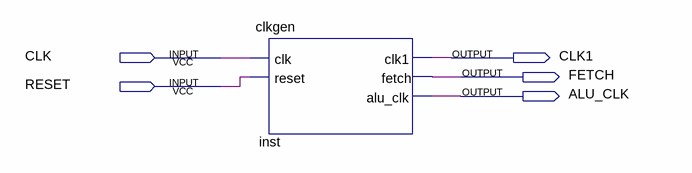
[diagram p0: schematic sheet]
// Quartus schematic clk_gen_bdf.bdf as structural Verilog: 1 symbols, 5 pins
module clk_gen_bdf (
  input  CLK,
  input  RESET,
  output CLK1,
  output FETCH,
  output ALU_CLK
);

  clkgen inst (.clk(CLK), .reset(RESET), .clk1(CLK1), .fetch(FETCH), .alu_clk(ALU_CLK));
endmodule
